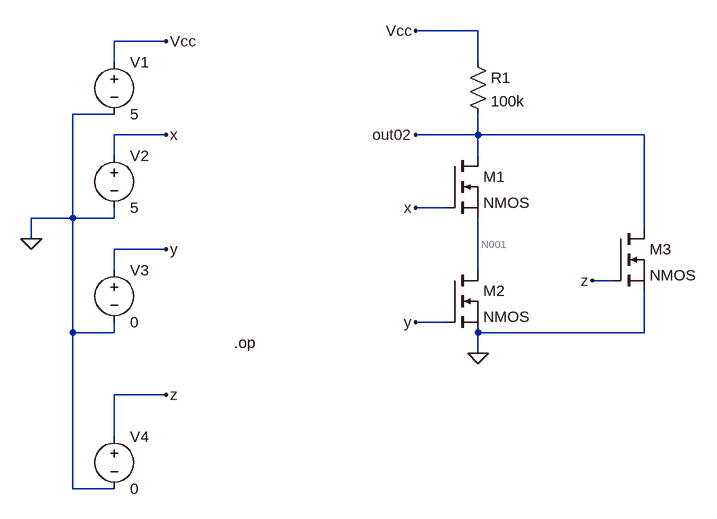
[diagram p0: schematic Task01part02.asc]
Task01part02.asc, the LTspice schematic file:
Version 4
SHEET 1 880 680
WIRE 304 -80 208 -80
WIRE -176 -64 -256 -64
WIRE -256 -32 -256 -64
WIRE 304 -32 304 -80
WIRE -256 48 -320 48
WIRE -176 80 -256 80
WIRE 304 80 304 48
WIRE 304 80 208 80
WIRE 560 80 304 80
WIRE -256 112 -256 80
WIRE 304 112 304 80
WIRE 256 192 208 192
WIRE -320 208 -320 48
WIRE -320 208 -384 208
WIRE -256 208 -256 192
WIRE -256 208 -320 208
WIRE 560 224 560 80
WIRE -384 240 -384 208
WIRE -176 256 -256 256
WIRE -256 288 -256 256
WIRE 304 288 304 208
WIRE 512 304 480 304
WIRE 256 368 208 368
WIRE -320 384 -320 208
WIRE -256 384 -256 368
WIRE -256 384 -320 384
WIRE 560 384 560 320
WIRE 560 384 304 384
WIRE 304 416 304 384
WIRE -176 480 -256 480
WIRE -256 544 -256 480
WIRE -320 624 -320 384
WIRE -256 624 -320 624
FLAG 304 416 0
FLAG -176 -64 Vcc
FLAG 208 -80 Vcc
FLAG -176 80 x
FLAG 208 192 x
FLAG -176 256 y
FLAG 208 368 y
FLAG -384 240 0
FLAG -176 480 z
FLAG 480 304 z
FLAG 208 80 out02
SYMBOL nmos 256 112 R0
SYMATTR InstName M1
SYMBOL nmos 256 288 R0
SYMATTR InstName M2
SYMBOL res 288 -48 R0
SYMATTR InstName R1
SYMATTR Value 100k
SYMBOL voltage -256 -48 R0
SYMATTR InstName V1
SYMATTR Value 5
SYMBOL voltage -256 96 R0
SYMATTR InstName V2
SYMATTR Value 5
SYMBOL voltage -256 272 R0
SYMATTR InstName V3
SYMATTR Value 0
SYMBOL voltage -256 528 R0
SYMATTR InstName V4
SYMATTR Value 0
SYMBOL nmos 512 224 R0
SYMATTR InstName M3
TEXT -72 400 Left 2 !.op

The netlist it stands for:
* Task01part02.asc
M1 out02 x N001 N001 NMOS
M2 N001 y 0 0 NMOS
R1 Vcc out02 100k
V1 Vcc 0 5
V2 x 0 5
V3 y 0 0
V4 z 0 0
M3 out02 z 0 0 NMOS
.model NMOS NMOS
.model PMOS PMOS
.lib standard.mos
.op
.backanno
.end

* Results of the author's LTspice run, read from the files saved beside the schematic
* Operating Point:
*   V(out02) = 5 V
*   V(x) = 5 V
*   V(n001) = 4.995 V
*   V(y) = 0 V
*   V(vcc) = 5 V
*   V(z) = 0 V
*   Id(M3) = 10.01 pA
*   Ig(M3) = 0 A
*   Ib(M3) = -5.01 pA
*   Is(M3) = -5 pA
*   Id(M2) = 10 pA
*   Ig(M2) = 0 A
*   Ib(M2) = -5.005 pA
*   Is(M2) = -4.995 pA
*   Id(M1) = 245.1 pA
*   Ig(M1) = 0 A
*   Ib(M1) = -6.69 fA
*   Is(M1) = -245.1 pA
*   I(R1) = 20.01 pA
*   I(V4) = 0 A
*   I(V3) = 0 A
*   I(V2) = 0 A
*   I(V1) = -20.01 pA
* From the log:
*   Semiconductor Device Operating Points:
*                           --- MOSFET Transistors ---
*   Name:          m3          m2          m1
*   Model:        nmos        nmos        nmos
*   Id:          1.00e-11    1.00e-11    2.45e-10
*   Vgs:         0.00e+00    0.00e+00    4.95e-03
*   Vds:         5.00e+00    5.00e+00    4.95e-03
*   Vbs:         0.00e+00    0.00e+00    0.00e+00
*   Vth:         0.00e+00    0.00e+00    0.00e+00
*   Vdsat:       0.00e+00    0.00e+00    4.95e-03
*   Gm:          0.00e+00    0.00e+00    9.90e-08
*   Gds:         0.00e+00    0.00e+00    4.00e-11
*   Gmb:         0.00e+00    0.00e+00    0.00e+00
*   Cbd:         0.00e+00    0.00e+00    0.00e+00
*   Cbs:         0.00e+00    0.00e+00    0.00e+00
*   Cgsov:       0.00e+00    0.00e+00    0.00e+00
*   Cgdov:       0.00e+00    0.00e+00    0.00e+00
*   Cgbov:       0.00e+00    0.00e+00    0.00e+00
*   Cgs:         0.00e+00    0.00e+00    0.00e+00
*   Cgd:         0.00e+00    0.00e+00    0.00e+00
*   Cgb:        -0.00e+00   -0.00e+00    0.00e+00